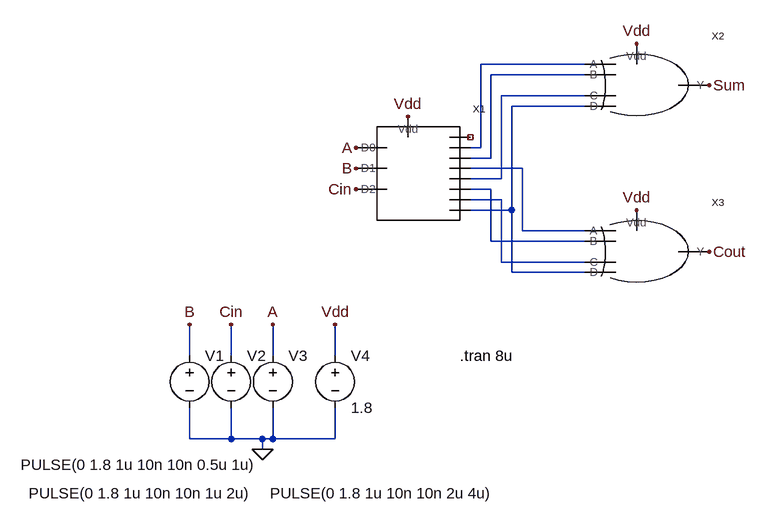
[diagram p0: schematic FAT.asc]
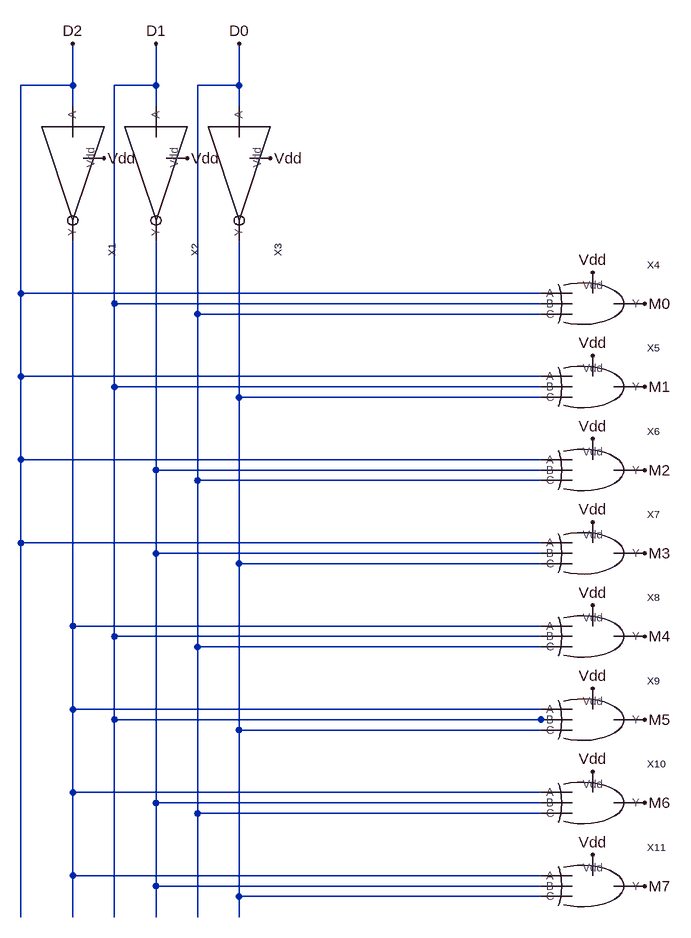
[diagram p1: sub-circuit decoder3x8.asc]
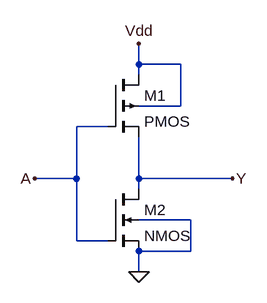
[diagram p2: sub-circuit not1.asc]
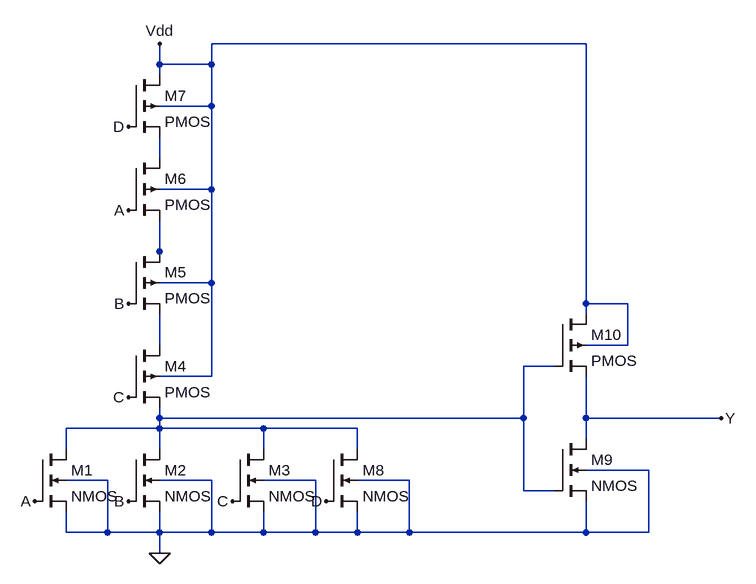
[diagram p3: sub-circuit or4.asc]
FAT.asc, the LTspice schematic file:
Version 4
SHEET 1 880 692
WIRE 368 16 208 16
WIRE 368 32 224 32
WIRE 368 64 240 64
WIRE 368 80 256 80
WIRE 208 144 208 16
WIRE 208 144 192 144
WIRE 224 160 224 32
WIRE 224 160 192 160
WIRE 272 176 192 176
WIRE 240 192 240 64
WIRE 240 192 192 192
WIRE 224 208 192 208
WIRE 240 224 192 224
WIRE 256 240 256 80
WIRE 256 240 192 240
WIRE 272 272 272 176
WIRE 368 272 272 272
WIRE 224 288 224 208
WIRE 368 288 224 288
WIRE 240 320 240 224
WIRE 368 320 240 320
WIRE 256 336 256 240
WIRE 368 336 256 336
WIRE -240 464 -240 416
WIRE -176 464 -176 416
WIRE -112 464 -112 416
WIRE -16 464 -16 416
WIRE -240 592 -240 544
WIRE -176 592 -176 544
WIRE -176 592 -240 592
WIRE -128 592 -176 592
WIRE -112 592 -112 544
WIRE -112 592 -128 592
WIRE -16 592 -16 544
WIRE -16 592 -112 592
WIRE -128 608 -128 592
FLAG 96 96 Vdd
FLAG 448 -16 Vdd
FLAG 448 240 Vdd
FLAG -16 416 Vdd
FLAG 16 144 A
FLAG 16 176 B
FLAG 16 208 Cin
FLAG 560 304 Cout
FLAG 560 48 Sum
FLAG -112 416 A
FLAG -176 416 Cin
FLAG -240 416 B
FLAG -128 608 0
SYMBOL decoder3x8 96 176 R0
SYMATTR InstName X1
SYMBOL OR4 416 48 R0
SYMATTR InstName X2
SYMBOL OR4 416 304 R0
SYMATTR InstName X3
SYMBOL voltage -240 448 R0
WINDOW 3 -248 228 Left 2
WINDOW 123 0 0 Left 0
WINDOW 39 0 0 Left 0
SYMATTR InstName V1
SYMATTR Value PULSE(0 1.8 1u 10n 10n 1u 2u)
SYMBOL voltage -176 448 R0
WINDOW 3 -324 184 Left 2
WINDOW 123 0 0 Left 0
WINDOW 39 0 0 Left 0
SYMATTR InstName V2
SYMATTR Value PULSE(0 1.8 1u 10n 10n 0.5u 1u)
SYMBOL voltage -112 448 R0
WINDOW 3 -4 228 Left 2
WINDOW 123 0 0 Left 0
WINDOW 39 0 0 Left 0
SYMATTR InstName V3
SYMATTR Value PULSE(0 1.8 1u 10n 10n 2u 4u)
SYMBOL voltage -16 448 R0
WINDOW 123 0 0 Left 0
WINDOW 39 0 0 Left 0
SYMATTR InstName V4
SYMATTR Value 1.8
TEXT 176 464 Left 2 !.tran 8u

decoder3x8.asc, the sub-circuit schematic file:
Version 4
SHEET 1 980 1228
WIRE 48 -64 48 -128
WIRE 48 -64 -32 -64
WIRE 176 -64 176 -128
WIRE 176 -64 112 -64
WIRE 304 -64 304 -128
WIRE 304 -64 240 -64
WIRE 48 -32 48 -64
WIRE 176 -32 176 -64
WIRE 304 -32 304 -64
WIRE -32 256 -32 -64
WIRE 768 256 -32 256
WIRE 112 272 112 -64
WIRE 768 272 112 272
WIRE 240 288 240 -64
WIRE 768 288 240 288
WIRE -32 384 -32 256
WIRE 768 384 -32 384
WIRE 112 400 112 272
WIRE 768 400 112 400
WIRE 304 416 304 176
WIRE 768 416 304 416
WIRE -32 512 -32 384
WIRE 768 512 -32 512
WIRE 176 528 176 176
WIRE 768 528 176 528
WIRE 240 544 240 288
WIRE 768 544 240 544
WIRE -32 640 -32 512
WIRE 768 640 -32 640
WIRE 176 656 176 528
WIRE 768 656 176 656
WIRE 304 672 304 416
WIRE 768 672 304 672
WIRE 48 768 48 176
WIRE 768 768 48 768
WIRE 112 784 112 400
WIRE 768 784 112 784
WIRE 240 800 240 544
WIRE 768 800 240 800
WIRE 48 896 48 768
WIRE 768 896 48 896
WIRE 112 912 112 784
WIRE 768 912 112 912
WIRE 784 912 768 912
WIRE 304 928 304 672
WIRE 768 928 304 928
WIRE 48 1024 48 896
WIRE 768 1024 48 1024
WIRE 176 1040 176 656
WIRE 768 1040 176 1040
WIRE 240 1056 240 800
WIRE 768 1056 240 1056
WIRE 48 1152 48 1024
WIRE 768 1152 48 1152
WIRE 176 1168 176 1040
WIRE 768 1168 176 1168
WIRE 304 1184 304 928
WIRE 768 1184 304 1184
WIRE -32 1216 -32 640
WIRE 48 1216 48 1152
WIRE 112 1216 112 912
WIRE 176 1216 176 1168
WIRE 240 1216 240 1056
WIRE 304 1216 304 1184
FLAG 48 -128 D2
FLAG 176 -128 D1
FLAG 304 -128 D0
FLAG 352 48 Vdd
FLAG 224 48 Vdd
FLAG 96 48 Vdd
FLAG 848 224 Vdd
FLAG 848 352 Vdd
FLAG 848 480 Vdd
FLAG 848 608 Vdd
FLAG 848 736 Vdd
FLAG 848 864 Vdd
FLAG 848 992 Vdd
FLAG 848 1120 Vdd
FLAG 928 272 M0
FLAG 928 400 M1
FLAG 928 528 M2
FLAG 928 656 M3
FLAG 928 784 M4
FLAG 928 912 M5
FLAG 928 1040 M6
FLAG 928 1168 M7
SYMBOL NOT1 48 48 R90
SYMATTR InstName X1
SYMBOL NOT1 176 48 R90
SYMATTR InstName X2
SYMBOL NOT1 304 48 R90
SYMATTR InstName X3
SYMBOL NOR3 816 272 R0
SYMATTR InstName X4
SYMBOL NOR3 816 400 R0
SYMATTR InstName X5
SYMBOL NOR3 816 528 R0
SYMATTR InstName X6
SYMBOL NOR3 816 656 R0
SYMATTR InstName X7
SYMBOL NOR3 816 784 R0
SYMATTR InstName X8
SYMBOL NOR3 816 912 R0
SYMATTR InstName X9
SYMBOL NOR3 816 1040 R0
SYMATTR InstName X10
SYMBOL NOR3 816 1168 R0
SYMATTR InstName X11

not1.asc, the sub-circuit schematic file:
Version 4
SHEET 1 880 680
WIRE 224 16 224 -16
WIRE 288 16 224 16
WIRE 224 32 224 16
WIRE 288 80 288 16
WIRE 288 80 224 80
WIRE 176 112 128 112
WIRE 128 192 128 112
WIRE 128 192 64 192
WIRE 224 192 224 128
WIRE 368 192 224 192
WIRE 224 208 224 192
WIRE 304 256 224 256
WIRE 128 288 128 192
WIRE 176 288 128 288
WIRE 304 304 304 256
WIRE 304 304 224 304
WIRE 224 336 224 304
FLAG 224 336 0
FLAG 224 -16 Vdd
FLAG 64 192 A
FLAG 368 192 Y
SYMBOL pmos4 176 32 R0
SYMATTR InstName M1
SYMBOL nmos4 176 208 R0
SYMATTR InstName M2

or4.asc, the sub-circuit schematic file:
Version 4
SHEET 1 960 680
WIRE 720 -160 144 -160
WIRE 64 -128 64 -160
WIRE 144 -128 144 -160
WIRE 144 -128 64 -128
WIRE 64 -112 64 -128
WIRE 144 -64 144 -128
WIRE 144 -64 64 -64
WIRE 64 16 64 -16
WIRE 144 64 144 -64
WIRE 144 64 64 64
WIRE 64 160 64 112
WIRE 64 176 64 160
WIRE 144 208 144 64
WIRE 144 208 64 208
WIRE 720 240 720 -160
WIRE 784 240 720 240
WIRE 720 256 720 240
WIRE 64 304 64 256
WIRE 784 304 784 240
WIRE 784 304 720 304
WIRE 672 336 624 336
WIRE 144 352 144 208
WIRE 144 352 64 352
WIRE 64 416 64 400
WIRE 624 416 624 336
WIRE 624 416 64 416
WIRE 720 416 720 352
WIRE 928 416 720 416
WIRE 64 432 64 416
WIRE 64 432 -80 432
WIRE 224 432 64 432
WIRE 368 432 224 432
WIRE 720 448 720 416
WIRE -80 464 -80 432
WIRE 64 464 64 432
WIRE 224 464 224 432
WIRE 368 464 368 432
WIRE 816 496 720 496
WIRE -16 512 -80 512
WIRE 144 512 64 512
WIRE 304 512 224 512
WIRE 448 512 368 512
WIRE 624 528 624 416
WIRE 672 528 624 528
WIRE -80 592 -80 560
WIRE -16 592 -16 512
WIRE -16 592 -80 592
WIRE 64 592 64 560
WIRE 64 592 -16 592
WIRE 144 592 144 512
WIRE 144 592 64 592
WIRE 224 592 224 560
WIRE 224 592 144 592
WIRE 304 592 304 512
WIRE 304 592 224 592
WIRE 368 592 368 560
WIRE 368 592 304 592
WIRE 448 592 448 512
WIRE 448 592 368 592
WIRE 720 592 720 544
WIRE 720 592 448 592
WIRE 816 592 816 496
WIRE 816 592 720 592
WIRE 64 624 64 592
FLAG 64 624 0
FLAG 16 96 A
FLAG 16 240 B
FLAG 16 384 C
FLAG -128 544 A
FLAG 16 544 B
FLAG 176 544 C
FLAG 64 -160 Vdd
FLAG 16 -32 D
FLAG 320 544 D
FLAG 928 416 Y
SYMBOL nmos4 -128 464 R0
SYMATTR InstName M1
SYMBOL nmos4 16 464 R0
SYMATTR InstName M2
SYMBOL nmos4 176 464 R0
SYMATTR InstName M3
SYMBOL pmos4 16 304 R0
SYMATTR InstName M4
SYMBOL pmos4 16 160 R0
SYMATTR InstName M5
SYMBOL pmos4 16 16 R0
SYMATTR InstName M6
SYMBOL pmos4 16 -112 R0
SYMATTR InstName M7
SYMBOL nmos4 320 464 R0
SYMATTR InstName M8
SYMBOL nmos4 672 448 R0
SYMATTR InstName M9
SYMBOL pmos4 672 256 R0
SYMATTR InstName M10

The netlist it stands for:
* FAT.asc
XX1 Cin B A NC_01 N001 N002 N005 N003 N006 N007 N004 Vdd decoder3x8
XX2 N001 N002 N003 N004 Vdd Sum or4
XX3 N005 N006 N007 N004 Vdd Cout or4
V1 B 0 PULSE(0 1.8 1u 10n 10n 1u 2u)
V2 Cin 0 PULSE(0 1.8 1u 10n 10n 0.5u 1u)
V3 A 0 PULSE(0 1.8 1u 10n 10n 2u 4u)
V4 Vdd 0 1.8

* block symbol definitions
.subckt decoder3x8 D2 D1 D0 M0 M1 M2 M3 M4 M5 M6 M7 Vdd
XX1 D2 N003 Vdd not1
XX2 D1 N002 Vdd not1
XX3 D0 N001 Vdd not1
XX4 D2 D1 D0 M0 Vdd NOR3  ; pins A B C Y Vdd
XX5 D2 D1 N001 M1 Vdd NOR3  ; pins A B C Y Vdd
XX6 D2 N002 D0 M2 Vdd NOR3  ; pins A B C Y Vdd
XX7 D2 N002 N001 M3 Vdd NOR3  ; pins A B C Y Vdd
XX8 N003 D1 D0 M4 Vdd NOR3  ; pins A B C Y Vdd
XX9 N003 D1 N001 M5 Vdd NOR3  ; pins A B C Y Vdd
XX10 N003 N002 D0 M6 Vdd NOR3  ; pins A B C Y Vdd
XX11 N003 N002 N001 M7 Vdd NOR3  ; pins A B C Y Vdd
.ends decoder3x8

.subckt not1 A Y Vdd
M1 Vdd A Y Vdd PMOS
M2 Y A 0 0 NMOS
.ends not1

.subckt or4 A B C D Vdd Y
M1 N004 A 0 0 NMOS
M2 N004 B 0 0 NMOS
M3 N004 C 0 0 NMOS
M4 N003 C N004 Vdd PMOS
M5 N002 B N003 Vdd PMOS
M6 N001 A N002 Vdd PMOS
M7 Vdd D N001 Vdd PMOS
M8 N004 D 0 0 NMOS
M9 Y N004 0 0 NMOS
M10 Vdd N004 Y Vdd PMOS
.ends or4

.model NMOS NMOS
.model PMOS PMOS
.lib standard.mos
.tran 8u
.backanno
.end

* Results of the author's LTspice run, read from the files saved beside the schematic
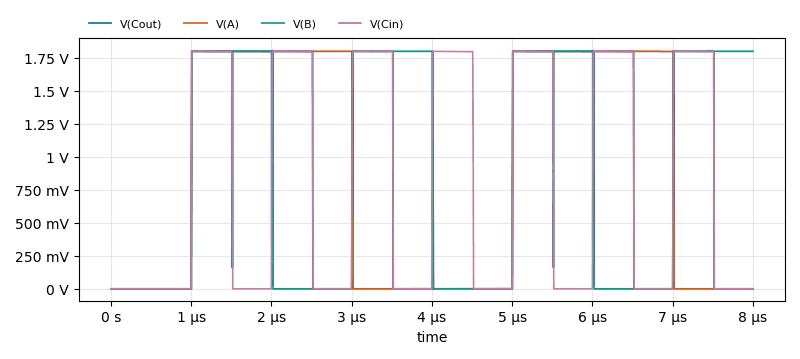
[diagram p4: Transient Analysis of FAT.asc, plotted from the saved traces]
* Transient Analysis, 1 run:
*   V(Cout): min 0 V, max 1.8 V, average 909.6 mV, rms 1.279 V, last 0 V
*   V(A): min 0 V, max 1.8 V, average 904.5 mV, rms 1.275 V, last 0 V
*   V(B): min 0 V, max 1.807 V, average 905.6 mV, rms 1.275 V, last 1.8 V
*   V(Cin): min 0 V, max 1.8 V, average 802.6 mV, rms 1.198 V, last 0 V